# Altium schematic sheet clock.SchDoc
size A3; DocumentNumber: 29; SheetNumber: 29; SheetTotal: 45; SheetDescription: System clocks
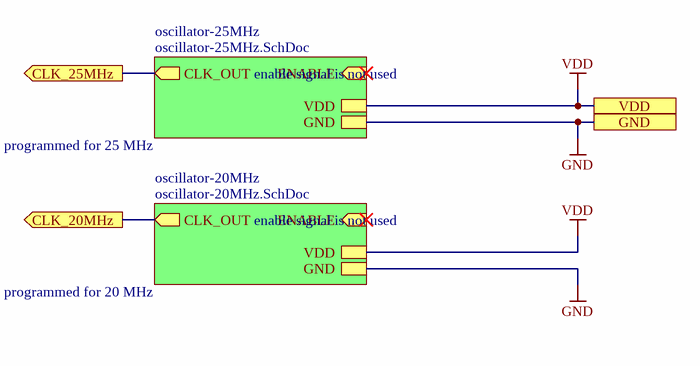
[diagram p0: clock.SchDoc]

## Sub-sheets
oscillator-20MHz = oscillator-20MHz.SchDoc: GND, ENABLE (in), CLK_OUT (out), VDD
oscillator-25MHz = oscillator-25MHz.SchDoc: GND, ENABLE (in), CLK_OUT (out), VDD

## Ports
CLK_20MHz (out), CLK_25MHz (out), GND, VDD

## Nets
GND: port GND, sheet oscillator-20MHz/GND, sheet oscillator-25MHz/GND
VDD: port VDD, sheet oscillator-20MHz/VDD, sheet oscillator-25MHz/VDD
CLK_20MHz: port CLK_20MHz, sheet oscillator-20MHz/CLK_OUT
CLK_25MHz: port CLK_25MHz, sheet oscillator-25MHz/CLK_OUT

## Notes on the sheet
- enable signal is not used
- programmed for 25 MHz
- programmed for 20 MHz
- Fraunhofer IISB
- Schottkystr. 10
- developed by:
- 91058 Erlangen
- Germany
- Author
- Project
- License
- Description
- File
- Version
- Release Date
- Sheet
- foxbms.org <https://foxbms.org>
- www.iisb.fraunhofer.de <https://www.iisb.fraunhofer.de/>
- foxBMS Team
- /